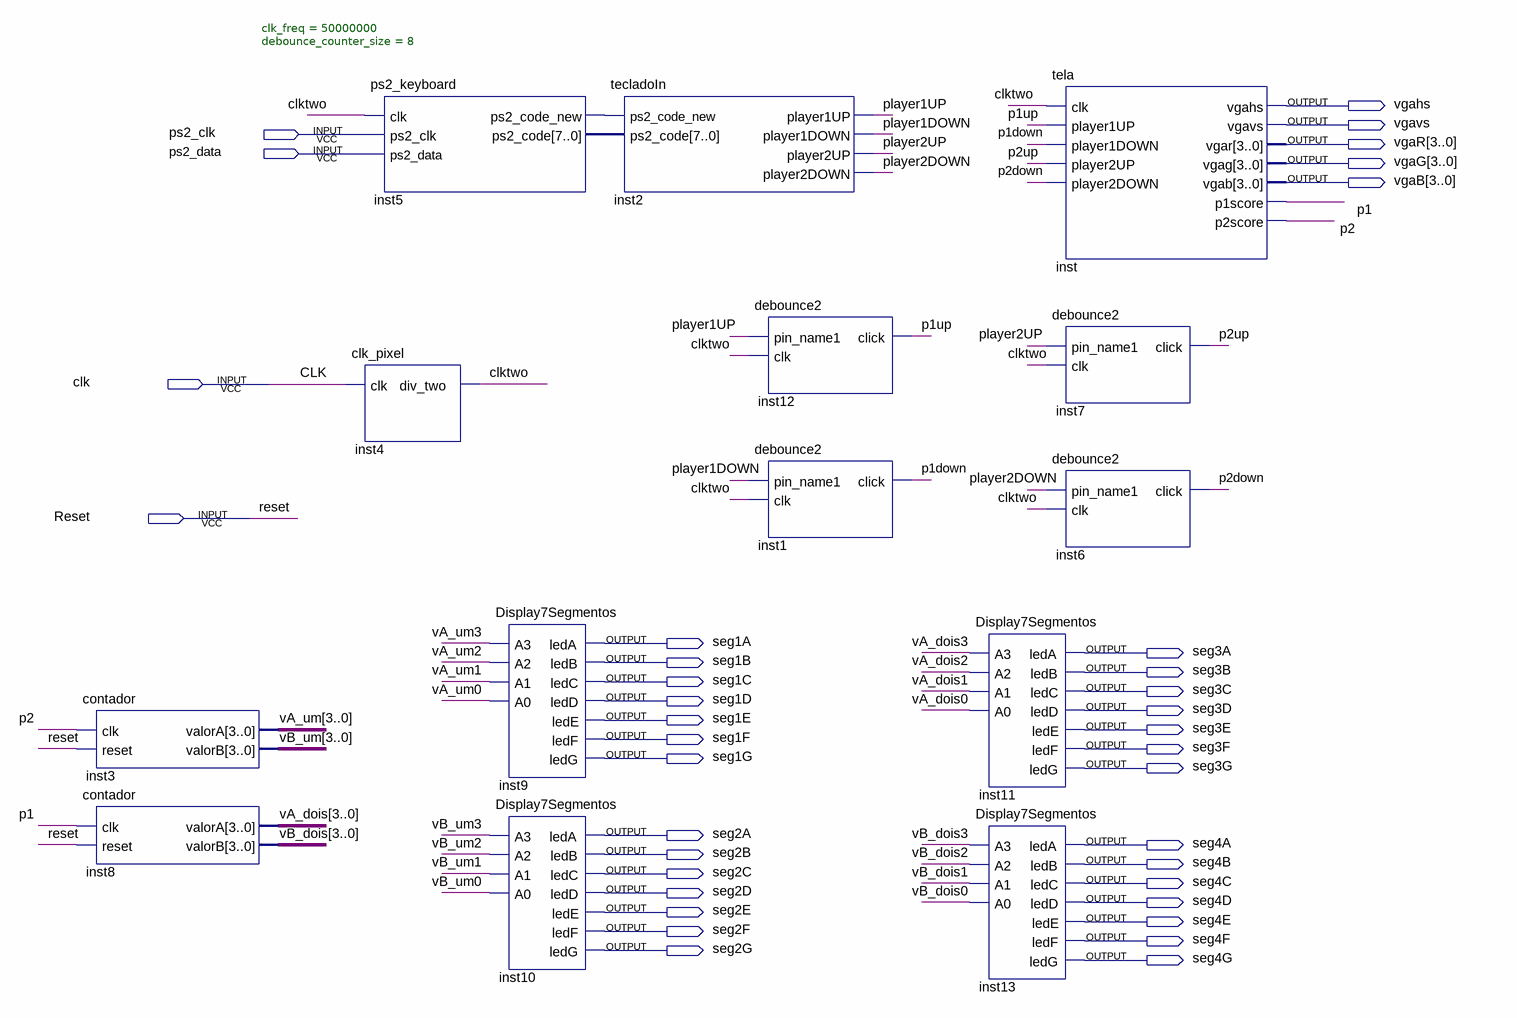
[diagram p0: schematic sheet]
// Quartus schematic Top.bdf as structural Verilog: 14 symbols, 37 pins
module Top (
  input  ps2_clk,
  input  ps2_data,
  input  clk,
  input  Reset,
  output vgahs,
  output vgavs,
  output [3:0] vgaR,
  output [3:0] vgaG,
  output [3:0] vgaB,
  output seg1A,
  output seg3A,
  output seg1B,
  output seg3B,
  output seg1C,
  output seg3C,
  output seg1D,
  output seg3D,
  output seg1E,
  output seg3E,
  output seg1F,
  output seg3F,
  output seg1G,
  output seg3G,
  output seg2A,
  output seg4A,
  output seg2B,
  output seg4B,
  output seg2C,
  output seg4C,
  output seg2D,
  output seg4D,
  output seg2E,
  output seg4E,
  output seg2F,
  output seg4F,
  output seg2G,
  output seg4G
);

  wire clktwo, inst5_ps2_code_new, p1, p1down, p1up, p2, p2down, p2up, player1DOWN, player1UP, player2DOWN,
       player2UP;
  wire [3:0] vA_dois, vA_um, vB_dois, vB_um;
  wire [7:0] inst5_ps2_code;

  contador inst3 (.clk(p2), .reset(Reset), .valorA(vA_um), .valorB(vB_um));
  contador inst8 (.clk(p1), .reset(Reset), .valorA(vA_dois), .valorB(vB_dois));
  ps2_keyboard #(.clk_freq(50000000), .debounce_counter_size(8)) inst5 (
    .clk(clktwo), .ps2_clk(ps2_clk), .ps2_data(ps2_data), .ps2_code_new(inst5_ps2_code_new),
    .ps2_code(inst5_ps2_code));
  clk_pixel inst4 (.clk(clk), .div_two(clktwo));
  Display7Segmentos inst9 (
    .A3(vA_um[3]), .A2(vA_um[2]), .A1(vA_um[1]), .A0(vA_um[0]), .ledA(seg1A), .ledB(seg1B), .ledC(seg1C),
    .ledD(seg1D), .ledE(seg1E), .ledF(seg1F), .ledG(seg1G));
  Display7Segmentos inst10 (
    .A3(vB_um[3]), .A2(vB_um[2]), .A1(vB_um[1]), .A0(vB_um[0]), .ledA(seg2A), .ledB(seg2B), .ledC(seg2C),
    .ledD(seg2D), .ledE(seg2E), .ledF(seg2F), .ledG(seg2G));
  tecladoIn inst2 (
    .ps2_code_new(inst5_ps2_code_new), .ps2_code(inst5_ps2_code), .player1UP(player1UP),
    .player1DOWN(player1DOWN), .player2UP(player2UP), .player2DOWN(player2DOWN));
  debounce2 inst12 (.pin_name1(player1UP), .clk(clktwo), .click(p1up));
  debounce2 inst1 (.pin_name1(player1DOWN), .clk(clktwo), .click(p1down));
  Display7Segmentos inst11 (
    .A3(vA_dois[3]), .A2(vA_dois[2]), .A1(vA_dois[1]), .A0(vA_dois[0]), .ledA(seg3A), .ledB(seg3B),
    .ledC(seg3C), .ledD(seg3D), .ledE(seg3E), .ledF(seg3F), .ledG(seg3G));
  Display7Segmentos inst13 (
    .A3(vB_dois[3]), .A2(vB_dois[2]), .A1(vB_dois[1]), .A0(vB_dois[0]), .ledA(seg4A), .ledB(seg4B),
    .ledC(seg4C), .ledD(seg4D), .ledE(seg4E), .ledF(seg4F), .ledG(seg4G));
  tela inst (
    .clk(clktwo), .player1UP(p1up), .player1DOWN(p1down), .player2UP(p2up), .player2DOWN(p2down),
    .vgahs(vgahs), .vgavs(vgavs), .vgar(vgaR), .vgag(vgaG), .vgab(vgaB), .p1score(p1), .p2score(p2));
  debounce2 inst7 (.pin_name1(player2UP), .clk(clktwo), .click(p2up));
  debounce2 inst6 (.pin_name1(player2DOWN), .clk(clktwo), .click(p2down));
endmodule
